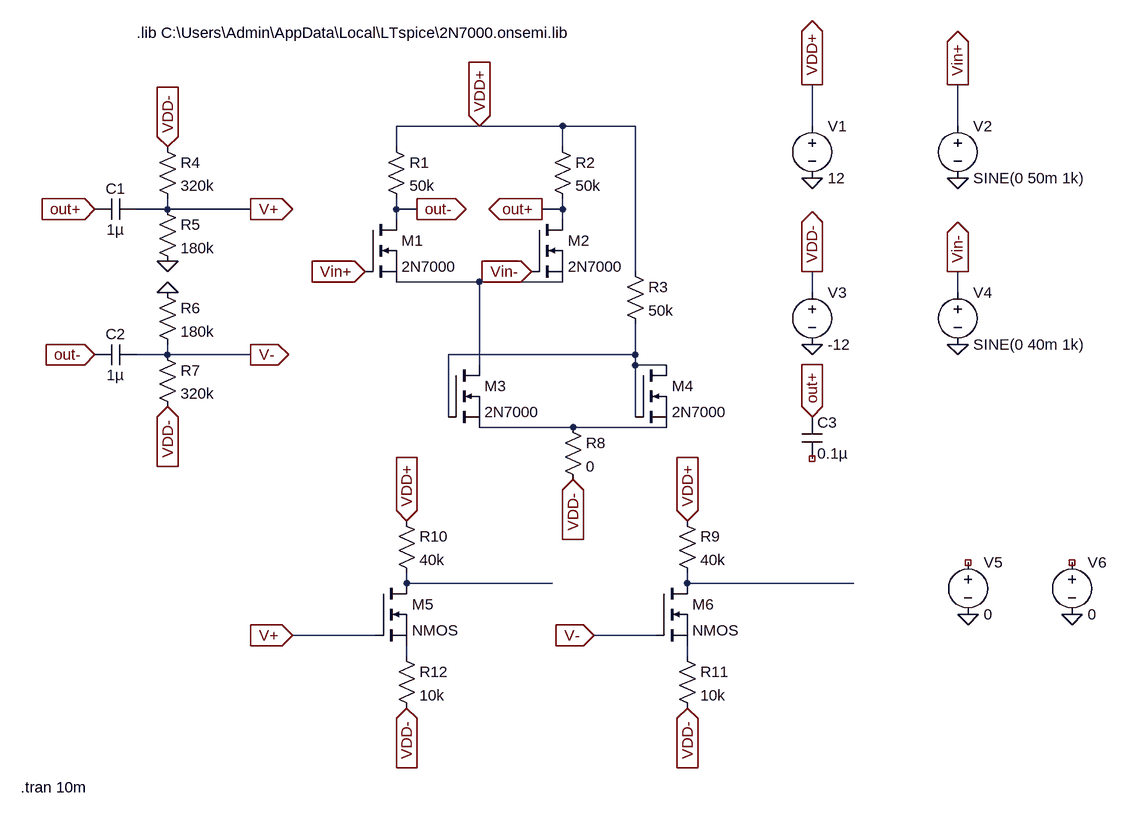
[diagram p0: schematic EW2_project1_try4.asc]
EW2_project1_try4.asc, the LTspice schematic file:
Version 4
SHEET 1 1240 1016
WIRE 272 -32 144 -32
WIRE 400 -32 272 -32
WIRE 512 -32 400 -32
WIRE 784 -32 784 -96
WIRE 1008 -32 1008 -96
WIRE 144 0 144 -32
WIRE 400 0 400 -32
WIRE -208 96 -208 80
WIRE -208 96 -256 96
WIRE -80 96 -208 96
WIRE 144 96 144 80
WIRE 176 96 144 96
WIRE 400 96 400 80
WIRE 400 96 368 96
WIRE 144 112 144 96
WIRE 400 112 400 96
WIRE 512 192 512 -32
WIRE 272 208 144 208
WIRE 400 208 272 208
WIRE 784 224 784 192
WIRE 1008 224 1008 192
WIRE -208 320 -208 304
WIRE -208 320 -256 320
WIRE -80 320 -208 320
WIRE 512 320 512 272
WIRE 512 320 224 320
WIRE 272 336 272 208
WIRE 512 336 512 320
WIRE 560 336 512 336
WIRE 224 416 224 320
WIRE 512 416 512 336
WIRE 416 432 272 432
WIRE 560 432 416 432
WIRE 160 672 160 656
WIRE 384 672 160 672
WIRE 592 672 592 656
WIRE 848 672 592 672
WIRE 112 752 -16 752
WIRE 544 752 448 752
WIRE 160 784 160 768
WIRE 592 784 592 768
FLAG 416 512 VDD-
IOPIN 416 512 In
FLAG 272 -32 VDD+
IOPIN 272 -32 In
FLAG 368 96 out+
IOPIN 368 96 Out
FLAG 176 96 out-
IOPIN 176 96 Out
FLAG 96 192 Vin+
IOPIN 96 192 In
FLAG 352 192 Vin-
IOPIN 352 192 In
FLAG 1008 48 0
FLAG 784 304 0
FLAG 784 48 0
FLAG 1008 304 0
FLAG 784 -96 VDD+
IOPIN 784 -96 Out
FLAG 784 192 VDD-
IOPIN 784 192 Out
FLAG 1008 192 Vin-
IOPIN 1008 192 Out
FLAG 1008 -96 Vin+
IOPIN 1008 -96 Out
FLAG -208 176 0
FLAG -208 224 0
FLAG -80 96 V+
IOPIN -80 96 Out
FLAG -80 320 V-
IOPIN -80 320 Out
FLAG -208 0 VDD-
IOPIN -208 0 In
FLAG -208 400 VDD-
IOPIN -208 400 In
FLAG -320 96 out+
IOPIN -320 96 In
FLAG -320 320 out-
IOPIN -320 320 In
FLAG 784 416 out+
IOPIN 784 416 In
FLAG 160 576 VDD+
IOPIN 160 576 In
FLAG 592 576 VDD+
IOPIN 592 576 In
FLAG 160 864 VDD-
IOPIN 160 864 In
FLAG 592 864 VDD-
IOPIN 592 864 In
FLAG -16 752 V+
IOPIN -16 752 In
FLAG 448 752 V-
IOPIN 448 752 In
FLAG 1024 720 0
FLAG 1184 720 0
SYMBOL nmos 96 112 R0
SYMATTR InstName M1
SYMATTR Value 2N7000
SYMATTR Prefix X
SYMBOL nmos 352 112 R0
SYMATTR InstName M2
SYMATTR Value 2N7000
SYMATTR Prefix X
SYMBOL nmos 224 336 R0
SYMATTR InstName M3
SYMATTR Value 2N7000
SYMATTR Prefix X
SYMBOL nmos 512 336 R0
SYMATTR InstName M4
SYMATTR Value 2N7000
SYMATTR Prefix X
SYMBOL res 128 -16 R0
SYMATTR InstName R1
SYMATTR Value 50k
SYMBOL res 384 -16 R0
SYMATTR InstName R2
SYMATTR Value 50k
SYMBOL res 496 176 R0
SYMATTR InstName R3
SYMATTR Value 50k
SYMBOL voltage 784 -48 R0
WINDOW 123 0 0 Left 0
WINDOW 39 0 0 Left 0
SYMATTR InstName V1
SYMATTR Value 12
SYMBOL voltage 1008 -48 R0
WINDOW 123 0 0 Left 0
WINDOW 39 0 0 Left 0
SYMATTR InstName V2
SYMATTR Value SINE(0 50m 1k)
SYMBOL voltage 784 208 R0
WINDOW 123 0 0 Left 0
WINDOW 39 0 0 Left 0
SYMATTR InstName V3
SYMATTR Value -12
SYMBOL voltage 1008 208 R0
WINDOW 123 0 0 Left 0
WINDOW 39 0 0 Left 0
SYMATTR InstName V4
SYMATTR Value SINE(0 40m 1k)
SYMBOL res -224 -16 R0
SYMATTR InstName R4
SYMATTR Value 320k
SYMBOL res -224 80 R0
SYMATTR InstName R5
SYMATTR Value 180k
SYMBOL res -224 208 R0
SYMATTR InstName R6
SYMATTR Value 180k
SYMBOL res -224 304 R0
SYMATTR InstName R7
SYMATTR Value 320k
SYMBOL cap -256 80 R90
WINDOW 0 0 32 VBottom 2
WINDOW 3 32 32 VTop 2
SYMATTR InstName C1
SYMATTR Value 1µ
SYMBOL cap -256 304 R90
WINDOW 0 0 32 VBottom 2
WINDOW 3 32 32 VTop 2
SYMATTR InstName C2
SYMATTR Value 1µ
SYMBOL res 400 416 R0
SYMATTR InstName R8
SYMATTR Value 0
SYMBOL cap 768 416 R0
SYMATTR InstName C3
SYMATTR Value 0.1µ
SYMBOL nmos 112 672 R0
SYMATTR InstName M5
SYMBOL nmos 544 672 R0
SYMATTR InstName M6
SYMBOL res 576 560 R0
SYMATTR InstName R9
SYMATTR Value 40k
SYMBOL res 144 560 R0
SYMATTR InstName R10
SYMATTR Value 40k
SYMBOL res 576 768 R0
SYMATTR InstName R11
SYMATTR Value 10k
SYMBOL res 144 768 R0
SYMATTR InstName R12
SYMATTR Value 10k
SYMBOL voltage 1024 624 R0
WINDOW 123 0 0 Left 0
WINDOW 39 0 0 Left 0
SYMATTR InstName V5
SYMATTR Value 0
SYMBOL voltage 1184 624 R0
WINDOW 123 0 0 Left 0
WINDOW 39 0 0 Left 0
SYMATTR InstName V6
SYMATTR Value 0
TEXT -256 -176 Left 2 !.lib C:\\Users\\Admin\\AppData\\Local\\LTspice\\2N7000.onsemi.lib
TEXT -434 986 Left 2 !.tran 10m

The netlist it stands for:
* EW2_project1_try4.asc
XM1 out- Vin+ N001 2N7000  ; pins D G S
XM2 out+ Vin- N001 2N7000  ; pins D G S
XM3 N001 N002 N003 2N7000  ; pins D G S
XM4 N002 N002 N003 2N7000  ; pins D G S
R1 VDD+ out- 50k
R2 VDD+ out+ 50k
R3 VDD+ N002 50k
V1 VDD+ 0 12
V2 Vin+ 0 SINE(0 50m 1k)
V3 VDD- 0 -12
V4 Vin- 0 SINE(0 40m 1k)
R4 VDD- V+ 320k
R5 V+ 0 180k
R6 0 V- 180k
R7 V- VDD- 320k
C1 V+ out+ 1µ
C2 V- out- 1µ
R8 N003 VDD- 0
C3 out+ NC_01 0.1µ
M5 N004 V+ N006 N006 NMOS
M6 N005 V- N007 N007 NMOS
R9 VDD+ N005 40k
R10 VDD+ N004 40k
R11 N007 VDD- 10k
R12 N006 VDD- 10k
V5 NC_02 0 0
V6 NC_03 0 0
.model NMOS NMOS
.model PMOS PMOS
.lib standard.mos
.lib C:\Users\Admin\AppData\Local\LTspice\2N7000.onsemi.lib
.tran 10m
.backanno
.end